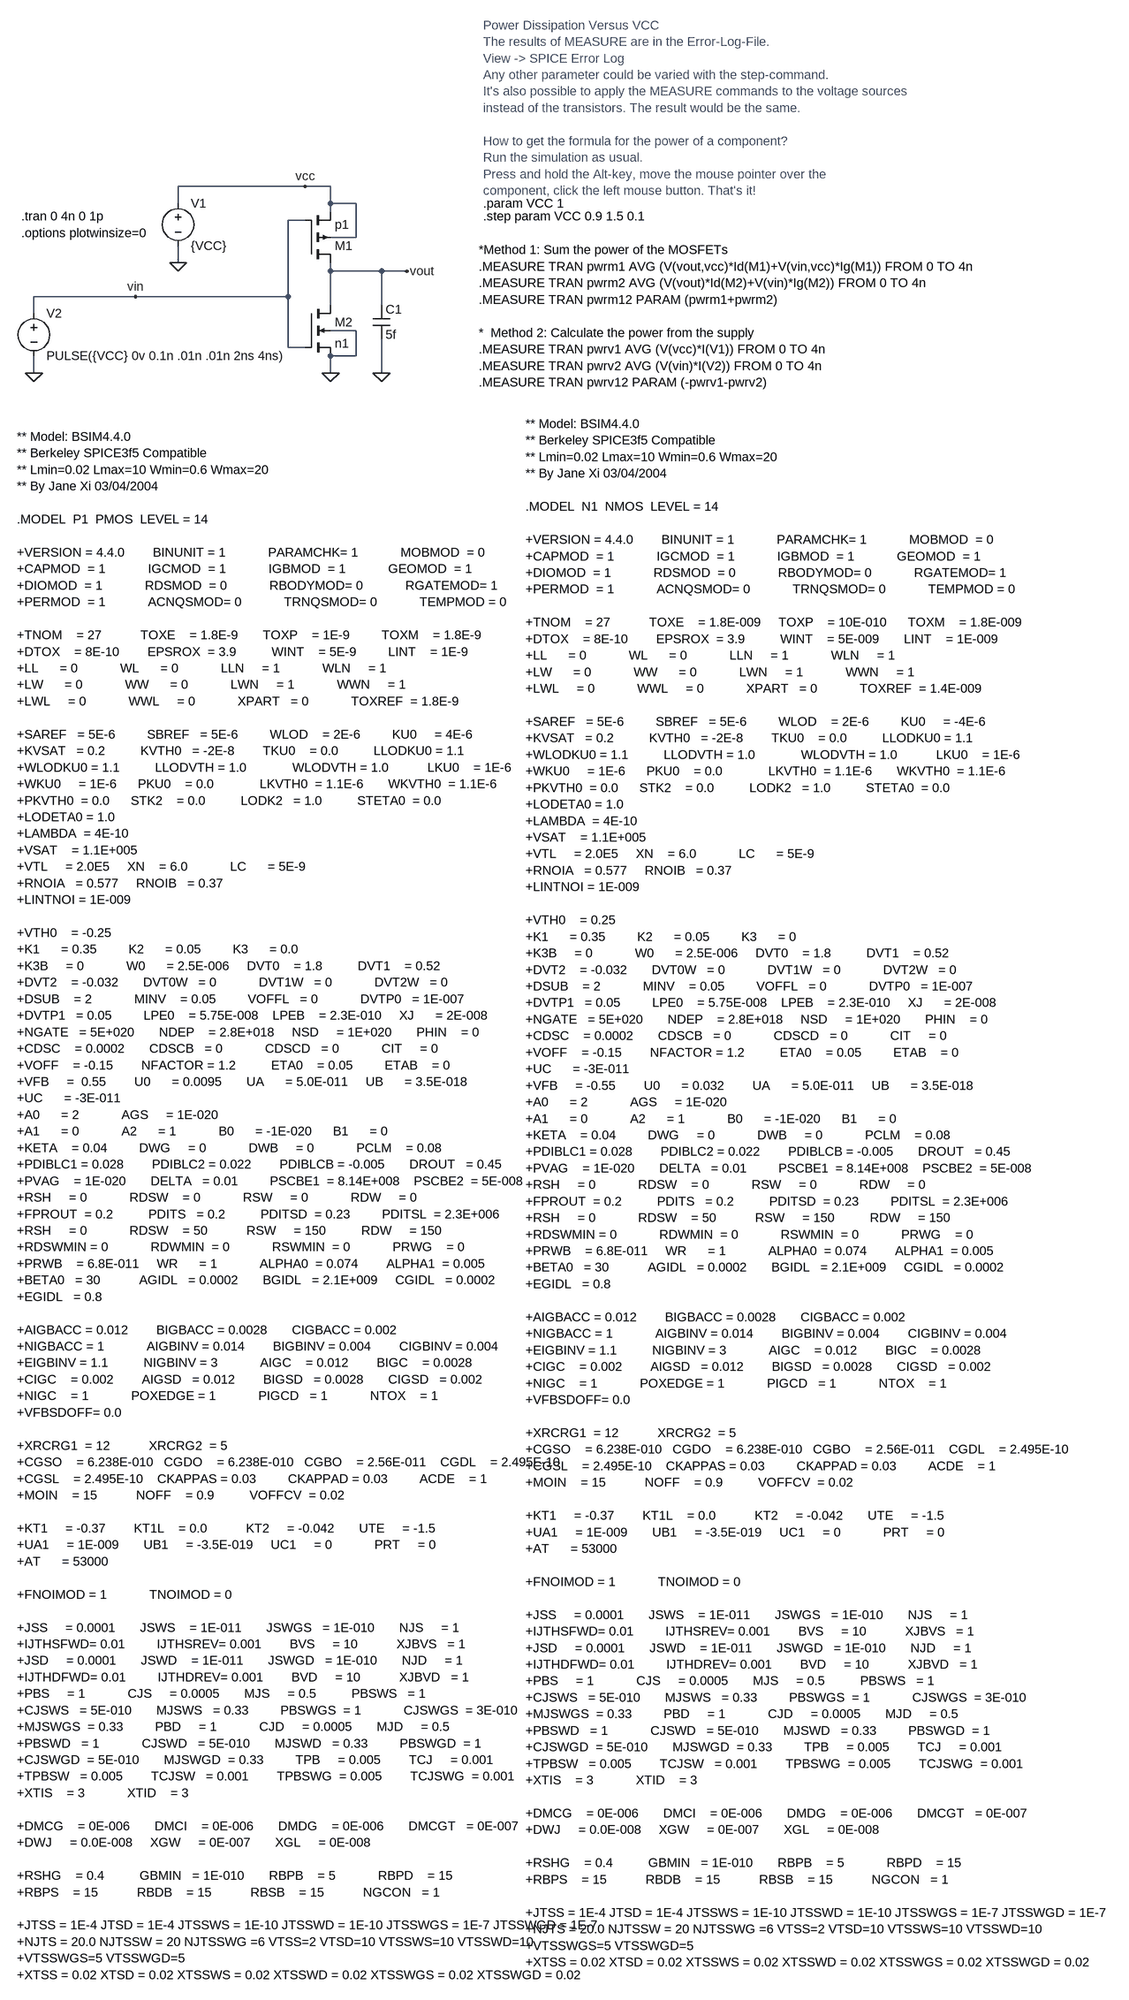
[diagram p0: schematic cmos__inverter_pwr_vcc.asc]
cmos__inverter_pwr_vcc.asc, the LTspice schematic file:
Version 4
SHEET 1 2036 3176
WIRE 224 64 -16 64
WIRE 272 64 224 64
WIRE -16 96 -16 64
WIRE 272 96 272 64
WIRE 320 96 272 96
WIRE 272 112 272 96
WIRE 224 128 192 128
WIRE 320 160 320 96
WIRE 320 160 272 160
WIRE -16 208 -16 176
WIRE 272 224 272 208
WIRE 368 224 272 224
WIRE 416 224 368 224
WIRE -96 272 -288 272
WIRE 192 272 192 128
WIRE 192 272 -96 272
WIRE 272 288 272 224
WIRE 368 288 368 224
WIRE -288 304 -288 272
WIRE 320 336 272 336
WIRE 192 368 192 272
WIRE 224 368 192 368
WIRE 320 384 320 336
WIRE 320 384 272 384
WIRE -288 416 -288 384
WIRE 272 416 272 384
WIRE 368 416 368 352
FLAG 272 416 0
FLAG -16 208 0
FLAG -288 416 0
FLAG 416 224 vout
FLAG -96 272 vin
FLAG 368 416 0
FLAG 224 64 vcc
SYMBOL pmos4 224 208 M180
SYMATTR InstName M1
SYMATTR Value p1
SYMATTR Value2 l=90n w=.2u ad=.9p as=.9p pd=250n ps=250n m=1
SYMBOL nmos4 224 288 R0
SYMATTR InstName M2
SYMATTR Value n1
SYMATTR Value2 l=90n w=.1u ad=.9p as=.9p pd=250n ps=250n m=1
SYMBOL voltage -16 80 R0
WINDOW 123 0 0 Left 0
WINDOW 39 0 0 Left 0
SYMATTR InstName V1
SYMATTR Value {VCC}
SYMBOL voltage -288 288 R0
WINDOW 123 0 0 Left 0
WINDOW 39 0 0 Left 0
SYMATTR InstName V2
SYMATTR Value PULSE({VCC} 0v 0.1n .01n .01n 2ns 4ns)
SYMBOL cap 352 288 R0
SYMATTR InstName C1
SYMATTR Value 5f
TEXT -320 536 Left 0 !** Model: BSIM4.4.0\n** Berkeley SPICE3f5 Compatible\n** Lmin=0.02 Lmax=10 Wmin=0.6 Wmax=20\n** By Jane Xi 03/04/2004\n \n.MODEL  P1  PMOS  LEVEL = 14\n \n+VERSION = 4.4.0        BINUNIT = 1            PARAMCHK= 1            MOBMOD  = 0          \n+CAPMOD  = 1            IGCMOD  = 1            IGBMOD  = 1            GEOMOD  = 1          \n+DIOMOD  = 1            RDSMOD  = 0            RBODYMOD= 0            RGATEMOD= 1          \n+PERMOD  = 1            ACNQSMOD= 0            TRNQSMOD= 0            TEMPMOD = 0\n \n+TNOM    = 27           TOXE    = 1.8E-9       TOXP    = 1E-9         TOXM    = 1.8E-9   \n+DTOX    = 8E-10        EPSROX  = 3.9          WINT    = 5E-9         LINT    = 1E-9   \n+LL      = 0            WL      = 0            LLN     = 1            WLN     = 1          \n+LW      = 0            WW      = 0            LWN     = 1            WWN     = 1          \n+LWL     = 0            WWL     = 0            XPART   = 0            TOXREF  = 1.8E-9   \n \n+SAREF   = 5E-6         SBREF   = 5E-6         WLOD    = 2E-6         KU0     = 4E-6\n+KVSAT   = 0.2          KVTH0   = -2E-8        TKU0    = 0.0          LLODKU0 = 1.1 \n+WLODKU0 = 1.1          LLODVTH = 1.0  	       WLODVTH = 1.0 	      LKU0    = 1E-6  \n+WKU0	 = 1E-6  	PKU0    = 0.0  	       LKVTH0  = 1.1E-6       WKVTH0  = 1.1E-6   \n+PKVTH0  = 0.0  	STK2    = 0.0          LODK2   = 1.0          STETA0  = 0.0  \n+LODETA0 = 1.0		\n+LAMBDA  = 4E-10\n+VSAT    = 1.1E+005     \n+VTL	 = 2.0E5 	XN	= 6.0 	       LC      = 5E-9 \n+RNOIA   = 0.577 	RNOIB   = 0.37\n+LINTNOI = 1E-009\n \n+VTH0    = -0.25         \n+K1      = 0.35         K2      = 0.05         K3      = 0.0          \n+K3B     = 0            W0      = 2.5E-006     DVT0    = 1.8          DVT1    = 0.52       \n+DVT2    = -0.032       DVT0W   = 0            DVT1W   = 0            DVT2W   = 0          \n+DSUB    = 2            MINV    = 0.05         VOFFL   = 0            DVTP0   = 1E-007     \n+DVTP1   = 0.05         LPE0    = 5.75E-008    LPEB    = 2.3E-010     XJ      = 2E-008     \n+NGATE   = 5E+020       NDEP    = 2.8E+018     NSD     = 1E+020       PHIN    = 0          \n+CDSC    = 0.0002       CDSCB   = 0            CDSCD   = 0            CIT     = 0          \n+VOFF    = -0.15        NFACTOR = 1.2          ETA0    = 0.05         ETAB    = 0          \n+VFB     =  0.55        U0      = 0.0095       UA      = 5.0E-011     UB      = 3.5E-018   \n+UC      = -3E-011      \n+A0      = 2            AGS     = 1E-020     \n+A1      = 0            A2      = 1            B0      = -1E-020      B1      = 0          \n+KETA    = 0.04         DWG     = 0            DWB     = 0            PCLM    = 0.08      \n+PDIBLC1 = 0.028        PDIBLC2 = 0.022        PDIBLCB = -0.005       DROUT   = 0.45       \n+PVAG    = 1E-020       DELTA   = 0.01         PSCBE1  = 8.14E+008    PSCBE2  = 5E-008     \n+RSH     = 0            RDSW    = 0            RSW     = 0            RDW     = 0        \n+FPROUT  = 0.2          PDITS   = 0.2          PDITSD  = 0.23         PDITSL  = 2.3E+006   \n+RSH     = 0            RDSW    = 50           RSW     = 150          RDW     = 150        \n+RDSWMIN = 0            RDWMIN  = 0            RSWMIN  = 0            PRWG    = 0          \n+PRWB    = 6.8E-011     WR      = 1            ALPHA0  = 0.074        ALPHA1  = 0.005      \n+BETA0   = 30           AGIDL   = 0.0002       BGIDL   = 2.1E+009     CGIDL   = 0.0002     \n+EGIDL   = 0.8          \n \n+AIGBACC = 0.012        BIGBACC = 0.0028       CIGBACC = 0.002\n+NIGBACC = 1            AIGBINV = 0.014        BIGBINV = 0.004        CIGBINV = 0.004\n+EIGBINV = 1.1          NIGBINV = 3            AIGC    = 0.012        BIGC    = 0.0028\n+CIGC    = 0.002        AIGSD   = 0.012        BIGSD   = 0.0028       CIGSD   = 0.002\n+NIGC    = 1            POXEDGE = 1            PIGCD   = 1            NTOX    = 1\n+VFBSDOFF= 0.0 \n \n+XRCRG1  = 12           XRCRG2  = 5          \n+CGSO    = 6.238E-010   CGDO    = 6.238E-010   CGBO    = 2.56E-011    CGDL    = 2.495E-10     \n+CGSL    = 2.495E-10    CKAPPAS = 0.03         CKAPPAD = 0.03         ACDE    = 1          \n+MOIN    = 15           NOFF    = 0.9          VOFFCV  = 0.02       \n \n+KT1     = -0.37        KT1L    = 0.0           KT2     = -0.042       UTE     = -1.5\n+UA1     = 1E-009       UB1     = -3.5E-019     UC1     = 0            PRT     = 0\n+AT      = 53000\n \n+FNOIMOD = 1            TNOIMOD = 0          \n \n+JSS     = 0.0001       JSWS    = 1E-011       JSWGS   = 1E-010       NJS     = 1          \n+IJTHSFWD= 0.01         IJTHSREV= 0.001        BVS     = 10           XJBVS   = 1          \n+JSD     = 0.0001       JSWD    = 1E-011       JSWGD   = 1E-010       NJD     = 1          \n+IJTHDFWD= 0.01         IJTHDREV= 0.001        BVD     = 10           XJBVD   = 1          \n+PBS     = 1            CJS     = 0.0005       MJS     = 0.5          PBSWS   = 1          \n+CJSWS   = 5E-010       MJSWS   = 0.33         PBSWGS  = 1            CJSWGS  = 3E-010     \n+MJSWGS  = 0.33         PBD     = 1            CJD     = 0.0005       MJD     = 0.5        \n+PBSWD   = 1            CJSWD   = 5E-010       MJSWD   = 0.33         PBSWGD  = 1          \n+CJSWGD  = 5E-010       MJSWGD  = 0.33         TPB     = 0.005        TCJ     = 0.001      \n+TPBSW   = 0.005        TCJSW   = 0.001        TPBSWG  = 0.005        TCJSWG  = 0.001      \n+XTIS    = 3            XTID    = 3          \n \n+DMCG    = 0E-006       DMCI    = 0E-006       DMDG    = 0E-006       DMCGT   = 0E-007     \n+DWJ     = 0.0E-008     XGW     = 0E-007       XGL     = 0E-008     \n \n+RSHG    = 0.4          GBMIN   = 1E-010       RBPB    = 5            RBPD    = 15         \n+RBPS    = 15           RBDB    = 15           RBSB    = 15           NGCON   = 1          \n \n+JTSS = 1E-4 JTSD = 1E-4 JTSSWS = 1E-10 JTSSWD = 1E-10 JTSSWGS = 1E-7 JTSSWGD = 1E-7  \n+NJTS = 20.0 NJTSSW = 20 NJTSSWG =6 VTSS=2 VTSD=10 VTSSWS=10 VTSSWD=10 \n+VTSSWGS=5 VTSSWGD=5\n+XTSS = 0.02 XTSD = 0.02 XTSSWS = 0.02 XTSSWD = 0.02 XTSSWGS = 0.02 XTSSWGD = 0.02
TEXT 640 512 Left 0 !** Model: BSIM4.4.0\n** Berkeley SPICE3f5 Compatible\n** Lmin=0.02 Lmax=10 Wmin=0.6 Wmax=20\n** By Jane Xi 03/04/2004\n \n.MODEL  N1  NMOS  LEVEL = 14\n \n+VERSION = 4.4.0        BINUNIT = 1            PARAMCHK= 1            MOBMOD  = 0          \n+CAPMOD  = 1            IGCMOD  = 1            IGBMOD  = 1            GEOMOD  = 1          \n+DIOMOD  = 1            RDSMOD  = 0            RBODYMOD= 0            RGATEMOD= 1          \n+PERMOD  = 1            ACNQSMOD= 0            TRNQSMOD= 0            TEMPMOD = 0\n \n+TNOM    = 27           TOXE    = 1.8E-009     TOXP    = 10E-010      TOXM    = 1.8E-009   \n+DTOX    = 8E-10        EPSROX  = 3.9          WINT    = 5E-009       LINT    = 1E-009   \n+LL      = 0            WL      = 0            LLN     = 1            WLN     = 1          \n+LW      = 0            WW      = 0            LWN     = 1            WWN     = 1          \n+LWL     = 0            WWL     = 0            XPART   = 0            TOXREF  = 1.4E-009   \n \n+SAREF   = 5E-6         SBREF   = 5E-6         WLOD    = 2E-6         KU0     = -4E-6\n+KVSAT   = 0.2          KVTH0   = -2E-8        TKU0    = 0.0          LLODKU0 = 1.1 \n+WLODKU0 = 1.1          LLODVTH = 1.0  	       WLODVTH = 1.0 	      LKU0    = 1E-6  \n+WKU0	 = 1E-6  	PKU0    = 0.0  	       LKVTH0  = 1.1E-6       WKVTH0  = 1.1E-6   \n+PKVTH0  = 0.0  	STK2    = 0.0          LODK2   = 1.0          STETA0  = 0.0  \n+LODETA0 = 1.0		\n+LAMBDA  = 4E-10\n+VSAT    = 1.1E+005     \n+VTL	 = 2.0E5 	XN	= 6.0 	       LC      = 5E-9 \n+RNOIA   = 0.577 	RNOIB   = 0.37\n+LINTNOI = 1E-009\n \n+VTH0    = 0.25         \n+K1      = 0.35         K2      = 0.05         K3      = 0          \n+K3B     = 0            W0      = 2.5E-006     DVT0    = 1.8          DVT1    = 0.52       \n+DVT2    = -0.032       DVT0W   = 0            DVT1W   = 0            DVT2W   = 0          \n+DSUB    = 2            MINV    = 0.05         VOFFL   = 0            DVTP0   = 1E-007     \n+DVTP1   = 0.05         LPE0    = 5.75E-008    LPEB    = 2.3E-010     XJ      = 2E-008     \n+NGATE   = 5E+020       NDEP    = 2.8E+018     NSD     = 1E+020       PHIN    = 0          \n+CDSC    = 0.0002       CDSCB   = 0            CDSCD   = 0            CIT     = 0          \n+VOFF    = -0.15        NFACTOR = 1.2          ETA0    = 0.05         ETAB    = 0          \n+UC      = -3E-011      \n+VFB     = -0.55        U0      = 0.032        UA      = 5.0E-011     UB      = 3.5E-018   \n+A0      = 2            AGS     = 1E-020     \n+A1      = 0            A2      = 1            B0      = -1E-020      B1      = 0          \n+KETA    = 0.04         DWG     = 0            DWB     = 0            PCLM    = 0.08      \n+PDIBLC1 = 0.028        PDIBLC2 = 0.022        PDIBLCB = -0.005       DROUT   = 0.45       \n+PVAG    = 1E-020       DELTA   = 0.01         PSCBE1  = 8.14E+008    PSCBE2  = 5E-008     \n+RSH     = 0            RDSW    = 0            RSW     = 0            RDW     = 0        \n+FPROUT  = 0.2          PDITS   = 0.2          PDITSD  = 0.23         PDITSL  = 2.3E+006   \n+RSH     = 0            RDSW    = 50           RSW     = 150          RDW     = 150        \n+RDSWMIN = 0            RDWMIN  = 0            RSWMIN  = 0            PRWG    = 0          \n+PRWB    = 6.8E-011     WR      = 1            ALPHA0  = 0.074        ALPHA1  = 0.005      \n+BETA0   = 30           AGIDL   = 0.0002       BGIDL   = 2.1E+009     CGIDL   = 0.0002     \n+EGIDL   = 0.8          \n \n+AIGBACC = 0.012        BIGBACC = 0.0028       CIGBACC = 0.002\n+NIGBACC = 1            AIGBINV = 0.014        BIGBINV = 0.004        CIGBINV = 0.004\n+EIGBINV = 1.1          NIGBINV = 3            AIGC    = 0.012        BIGC    = 0.0028\n+CIGC    = 0.002        AIGSD   = 0.012        BIGSD   = 0.0028       CIGSD   = 0.002\n+NIGC    = 1            POXEDGE = 1            PIGCD   = 1            NTOX    = 1\n+VFBSDOFF= 0.0  	\n \n+XRCRG1  = 12           XRCRG2  = 5          \n+CGSO    = 6.238E-010   CGDO    = 6.238E-010   CGBO    = 2.56E-011    CGDL    = 2.495E-10     \n+CGSL    = 2.495E-10    CKAPPAS = 0.03         CKAPPAD = 0.03         ACDE    = 1          \n+MOIN    = 15           NOFF    = 0.9          VOFFCV  = 0.02       \n \n+KT1     = -0.37        KT1L    = 0.0           KT2     = -0.042       UTE     = -1.5\n+UA1     = 1E-009       UB1     = -3.5E-019     UC1     = 0            PRT     = 0\n+AT      = 53000\n \n+FNOIMOD = 1            TNOIMOD = 0          \n \n+JSS     = 0.0001       JSWS    = 1E-011       JSWGS   = 1E-010       NJS     = 1          \n+IJTHSFWD= 0.01         IJTHSREV= 0.001        BVS     = 10           XJBVS   = 1          \n+JSD     = 0.0001       JSWD    = 1E-011       JSWGD   = 1E-010       NJD     = 1          \n+IJTHDFWD= 0.01         IJTHDREV= 0.001        BVD     = 10           XJBVD   = 1          \n+PBS     = 1            CJS     = 0.0005       MJS     = 0.5          PBSWS   = 1          \n+CJSWS   = 5E-010       MJSWS   = 0.33         PBSWGS  = 1            CJSWGS  = 3E-010     \n+MJSWGS  = 0.33         PBD     = 1            CJD     = 0.0005       MJD     = 0.5        \n+PBSWD   = 1            CJSWD   = 5E-010       MJSWD   = 0.33         PBSWGD  = 1          \n+CJSWGD  = 5E-010       MJSWGD  = 0.33         TPB     = 0.005        TCJ     = 0.001      \n+TPBSW   = 0.005        TCJSW   = 0.001        TPBSWG  = 0.005        TCJSWG  = 0.001      \n+XTIS    = 3            XTID    = 3          \n \n+DMCG    = 0E-006       DMCI    = 0E-006       DMDG    = 0E-006       DMCGT   = 0E-007     \n+DWJ     = 0.0E-008     XGW     = 0E-007       XGL     = 0E-008     \n \n+RSHG    = 0.4          GBMIN   = 1E-010       RBPB    = 5            RBPD    = 15         \n+RBPS    = 15           RBDB    = 15           RBSB    = 15           NGCON   = 1          \n \n+JTSS = 1E-4 JTSD = 1E-4 JTSSWS = 1E-10 JTSSWD = 1E-10 JTSSWGS = 1E-7 JTSSWGD = 1E-7  \n+NJTS = 20.0 NJTSSW = 20 NJTSSWG =6 VTSS=2 VTSD=10 VTSSWS=10 VTSSWD=10 \n+VTSSWGS=5 VTSSWGD=5\n+XTSS = 0.02 XTSD = 0.02 XTSSWS = 0.02 XTSSWD = 0.02 XTSSWGS = 0.02 XTSSWGD = 0.02
TEXT -312 120 Left 0 !.tran 0 4n 0 1p
TEXT 552 184 Left 0 !*Method 1: Sum the power of the MOSFETs\n.MEASURE TRAN pwrm1 AVG (V(vout,vcc)*Id(M1)+V(vin,vcc)*Ig(M1)) FROM 0 TO 4n\n.MEASURE TRAN pwrm2 AVG (V(vout)*Id(M2)+V(vin)*Ig(M2)) FROM 0 TO 4n\n.MEASURE TRAN pwrm12 PARAM (pwrm1+pwrm2)\n \n*  Method 2: Calculate the power from the supply\n.MEASURE TRAN pwrv1 AVG (V(vcc)*I(V1)) FROM 0 TO 4n\n.MEASURE TRAN pwrv2 AVG (V(vin)*I(V2)) FROM 0 TO 4n\n.MEASURE TRAN pwrv12 PARAM (-pwrv1-pwrv2)
TEXT -312 152 Left 0 !.options plotwinsize=0
TEXT 560 120 Left 0 !.step param VCC 0.9 1.5 0.1
TEXT 560 96 Left 0 !.param VCC 1
TEXT 560 -240 Left 0 ;Power Dissipation Versus VCC\nThe results of MEASURE are in the Error-Log-File.\nView -> SPICE Error Log\nAny other parameter could be varied with the step-command.\nIt's also possible to apply the MEASURE commands to the voltage sources \ninstead of the transistors. The result would be the same.\n \nHow to get the formula for the power of a component?\nRun the simulation as usual.\nPress and hold the Alt-key, move the mouse pointer over the\ncomponent, click the left mouse button. That's it!

The netlist it stands for:
* cmos__inverter_pwr_vcc.asc
M1 vout vin vcc vcc p1 l=90n w=.2u ad=.9p as=.9p pd=250n ps=250n m=1
M2 vout vin 0 0 n1 l=90n w=.1u ad=.9p as=.9p pd=250n ps=250n m=1
V1 vcc 0 {VCC}
V2 vin 0 PULSE({VCC} 0v 0.1n .01n .01n 2ns 4ns)
C1 vout 0 5f
.model NMOS NMOS
.model PMOS PMOS
.lib standard.mos
** Model: BSIM4.4.0
** Berkeley SPICE3f5 Compatible
** Lmin=0.02 Lmax=10 Wmin=0.6 Wmax=20
** By Jane Xi 03/04/2004
.MODEL  P1  PMOS  LEVEL = 14
+VERSION = 4.4.0        BINUNIT = 1            PARAMCHK= 1            MOBMOD  = 0
+CAPMOD  = 1            IGCMOD  = 1            IGBMOD  = 1            GEOMOD  = 1
+DIOMOD  = 1            RDSMOD  = 0            RBODYMOD= 0            RGATEMOD= 1
+PERMOD  = 1            ACNQSMOD= 0            TRNQSMOD= 0            TEMPMOD = 0
+TNOM    = 27           TOXE    = 1.8E-9       TOXP    = 1E-9         TOXM    = 1.8E-9
+DTOX    = 8E-10        EPSROX  = 3.9          WINT    = 5E-9         LINT    = 1E-9
+LL      = 0            WL      = 0            LLN     = 1            WLN     = 1
+LW      = 0            WW      = 0            LWN     = 1            WWN     = 1
+LWL     = 0            WWL     = 0            XPART   = 0            TOXREF  = 1.8E-9
+SAREF   = 5E-6         SBREF   = 5E-6         WLOD    = 2E-6         KU0     = 4E-6
+KVSAT   = 0.2          KVTH0   = -2E-8        TKU0    = 0.0          LLODKU0 = 1.1
+WLODKU0 = 1.1          LLODVTH = 1.0  	       WLODVTH = 1.0 	      LKU0    = 1E-6
+WKU0	 = 1E-6  	PKU0    = 0.0  	       LKVTH0  = 1.1E-6       WKVTH0  = 1.1E-6
+PKVTH0  = 0.0  	STK2    = 0.0          LODK2   = 1.0          STETA0  = 0.0
+LODETA0 = 1.0
+LAMBDA  = 4E-10
+VSAT    = 1.1E+005
+VTL	 = 2.0E5 	XN	= 6.0 	       LC      = 5E-9
+RNOIA   = 0.577 	RNOIB   = 0.37
+LINTNOI = 1E-009
+VTH0    = -0.25
+K1      = 0.35         K2      = 0.05         K3      = 0.0
+K3B     = 0            W0      = 2.5E-006     DVT0    = 1.8          DVT1    = 0.52
+DVT2    = -0.032       DVT0W   = 0            DVT1W   = 0            DVT2W   = 0
+DSUB    = 2            MINV    = 0.05         VOFFL   = 0            DVTP0   = 1E-007
+DVTP1   = 0.05         LPE0    = 5.75E-008    LPEB    = 2.3E-010     XJ      = 2E-008
+NGATE   = 5E+020       NDEP    = 2.8E+018     NSD     = 1E+020       PHIN    = 0
+CDSC    = 0.0002       CDSCB   = 0            CDSCD   = 0            CIT     = 0
+VOFF    = -0.15        NFACTOR = 1.2          ETA0    = 0.05         ETAB    = 0
+VFB     =  0.55        U0      = 0.0095       UA      = 5.0E-011     UB      = 3.5E-018
+UC      = -3E-011
+A0      = 2            AGS     = 1E-020
+A1      = 0            A2      = 1            B0      = -1E-020      B1      = 0
+KETA    = 0.04         DWG     = 0            DWB     = 0            PCLM    = 0.08
+PDIBLC1 = 0.028        PDIBLC2 = 0.022        PDIBLCB = -0.005       DROUT   = 0.45
+PVAG    = 1E-020       DELTA   = 0.01         PSCBE1  = 8.14E+008    PSCBE2  = 5E-008
+RSH     = 0            RDSW    = 0            RSW     = 0            RDW     = 0
+FPROUT  = 0.2          PDITS   = 0.2          PDITSD  = 0.23         PDITSL  = 2.3E+006
+RSH     = 0            RDSW    = 50           RSW     = 150          RDW     = 150
+RDSWMIN = 0            RDWMIN  = 0            RSWMIN  = 0            PRWG    = 0
+PRWB    = 6.8E-011     WR      = 1            ALPHA0  = 0.074        ALPHA1  = 0.005
+BETA0   = 30           AGIDL   = 0.0002       BGIDL   = 2.1E+009     CGIDL   = 0.0002
+EGIDL   = 0.8
+AIGBACC = 0.012        BIGBACC = 0.0028       CIGBACC = 0.002
+NIGBACC = 1            AIGBINV = 0.014        BIGBINV = 0.004        CIGBINV = 0.004
+EIGBINV = 1.1          NIGBINV = 3            AIGC    = 0.012        BIGC    = 0.0028
+CIGC    = 0.002        AIGSD   = 0.012        BIGSD   = 0.0028       CIGSD   = 0.002
+NIGC    = 1            POXEDGE = 1            PIGCD   = 1            NTOX    = 1
+VFBSDOFF= 0.0
+XRCRG1  = 12           XRCRG2  = 5
+CGSO    = 6.238E-010   CGDO    = 6.238E-010   CGBO    = 2.56E-011    CGDL    = 2.495E-10
+CGSL    = 2.495E-10    CKAPPAS = 0.03         CKAPPAD = 0.03         ACDE    = 1
+MOIN    = 15           NOFF    = 0.9          VOFFCV  = 0.02
+KT1     = -0.37        KT1L    = 0.0           KT2     = -0.042       UTE     = -1.5
+UA1     = 1E-009       UB1     = -3.5E-019     UC1     = 0            PRT     = 0
+AT      = 53000
+FNOIMOD = 1            TNOIMOD = 0
+JSS     = 0.0001       JSWS    = 1E-011       JSWGS   = 1E-010       NJS     = 1
+IJTHSFWD= 0.01         IJTHSREV= 0.001        BVS     = 10           XJBVS   = 1
+JSD     = 0.0001       JSWD    = 1E-011       JSWGD   = 1E-010       NJD     = 1
+IJTHDFWD= 0.01         IJTHDREV= 0.001        BVD     = 10           XJBVD   = 1
+PBS     = 1            CJS     = 0.0005       MJS     = 0.5          PBSWS   = 1
+CJSWS   = 5E-010       MJSWS   = 0.33         PBSWGS  = 1            CJSWGS  = 3E-010
+MJSWGS  = 0.33         PBD     = 1            CJD     = 0.0005       MJD     = 0.5
+PBSWD   = 1            CJSWD   = 5E-010       MJSWD   = 0.33         PBSWGD  = 1
+CJSWGD  = 5E-010       MJSWGD  = 0.33         TPB     = 0.005        TCJ     = 0.001
+TPBSW   = 0.005        TCJSW   = 0.001        TPBSWG  = 0.005        TCJSWG  = 0.001
+XTIS    = 3            XTID    = 3
+DMCG    = 0E-006       DMCI    = 0E-006       DMDG    = 0E-006       DMCGT   = 0E-007
+DWJ     = 0.0E-008     XGW     = 0E-007       XGL     = 0E-008
+RSHG    = 0.4          GBMIN   = 1E-010       RBPB    = 5            RBPD    = 15
+RBPS    = 15           RBDB    = 15           RBSB    = 15           NGCON   = 1
+JTSS = 1E-4 JTSD = 1E-4 JTSSWS = 1E-10 JTSSWD = 1E-10 JTSSWGS = 1E-7 JTSSWGD = 1E-7
+NJTS = 20.0 NJTSSW = 20 NJTSSWG =6 VTSS=2 VTSD=10 VTSSWS=10 VTSSWD=10
+VTSSWGS=5 VTSSWGD=5
+XTSS = 0.02 XTSD = 0.02 XTSSWS = 0.02 XTSSWD = 0.02 XTSSWGS = 0.02 XTSSWGD = 0.02
** Model: BSIM4.4.0
** Berkeley SPICE3f5 Compatible
** Lmin=0.02 Lmax=10 Wmin=0.6 Wmax=20
** By Jane Xi 03/04/2004
.MODEL  N1  NMOS  LEVEL = 14
+VERSION = 4.4.0        BINUNIT = 1            PARAMCHK= 1            MOBMOD  = 0
+CAPMOD  = 1            IGCMOD  = 1            IGBMOD  = 1            GEOMOD  = 1
+DIOMOD  = 1            RDSMOD  = 0            RBODYMOD= 0            RGATEMOD= 1
+PERMOD  = 1            ACNQSMOD= 0            TRNQSMOD= 0            TEMPMOD = 0
+TNOM    = 27           TOXE    = 1.8E-009     TOXP    = 10E-010      TOXM    = 1.8E-009
+DTOX    = 8E-10        EPSROX  = 3.9          WINT    = 5E-009       LINT    = 1E-009
+LL      = 0            WL      = 0            LLN     = 1            WLN     = 1
+LW      = 0            WW      = 0            LWN     = 1            WWN     = 1
+LWL     = 0            WWL     = 0            XPART   = 0            TOXREF  = 1.4E-009
+SAREF   = 5E-6         SBREF   = 5E-6         WLOD    = 2E-6         KU0     = -4E-6
+KVSAT   = 0.2          KVTH0   = -2E-8        TKU0    = 0.0          LLODKU0 = 1.1
+WLODKU0 = 1.1          LLODVTH = 1.0  	       WLODVTH = 1.0 	      LKU0    = 1E-6
+WKU0	 = 1E-6  	PKU0    = 0.0  	       LKVTH0  = 1.1E-6       WKVTH0  = 1.1E-6
+PKVTH0  = 0.0  	STK2    = 0.0          LODK2   = 1.0          STETA0  = 0.0
+LODETA0 = 1.0
+LAMBDA  = 4E-10
+VSAT    = 1.1E+005
+VTL	 = 2.0E5 	XN	= 6.0 	       LC      = 5E-9
+RNOIA   = 0.577 	RNOIB   = 0.37
+LINTNOI = 1E-009
+VTH0    = 0.25
+K1      = 0.35         K2      = 0.05         K3      = 0
+K3B     = 0            W0      = 2.5E-006     DVT0    = 1.8          DVT1    = 0.52
+DVT2    = -0.032       DVT0W   = 0            DVT1W   = 0            DVT2W   = 0
+DSUB    = 2            MINV    = 0.05         VOFFL   = 0            DVTP0   = 1E-007
+DVTP1   = 0.05         LPE0    = 5.75E-008    LPEB    = 2.3E-010     XJ      = 2E-008
+NGATE   = 5E+020       NDEP    = 2.8E+018     NSD     = 1E+020       PHIN    = 0
+CDSC    = 0.0002       CDSCB   = 0            CDSCD   = 0            CIT     = 0
+VOFF    = -0.15        NFACTOR = 1.2          ETA0    = 0.05         ETAB    = 0
+UC      = -3E-011
+VFB     = -0.55        U0      = 0.032        UA      = 5.0E-011     UB      = 3.5E-018
+A0      = 2            AGS     = 1E-020
+A1      = 0            A2      = 1            B0      = -1E-020      B1      = 0
+KETA    = 0.04         DWG     = 0            DWB     = 0            PCLM    = 0.08
+PDIBLC1 = 0.028        PDIBLC2 = 0.022        PDIBLCB = -0.005       DROUT   = 0.45
+PVAG    = 1E-020       DELTA   = 0.01         PSCBE1  = 8.14E+008    PSCBE2  = 5E-008
+RSH     = 0            RDSW    = 0            RSW     = 0            RDW     = 0
+FPROUT  = 0.2          PDITS   = 0.2          PDITSD  = 0.23         PDITSL  = 2.3E+006
+RSH     = 0            RDSW    = 50           RSW     = 150          RDW     = 150
+RDSWMIN = 0            RDWMIN  = 0            RSWMIN  = 0            PRWG    = 0
+PRWB    = 6.8E-011     WR      = 1            ALPHA0  = 0.074        ALPHA1  = 0.005
+BETA0   = 30           AGIDL   = 0.0002       BGIDL   = 2.1E+009     CGIDL   = 0.0002
+EGIDL   = 0.8
+AIGBACC = 0.012        BIGBACC = 0.0028       CIGBACC = 0.002
+NIGBACC = 1            AIGBINV = 0.014        BIGBINV = 0.004        CIGBINV = 0.004
+EIGBINV = 1.1          NIGBINV = 3            AIGC    = 0.012        BIGC    = 0.0028
+CIGC    = 0.002        AIGSD   = 0.012        BIGSD   = 0.0028       CIGSD   = 0.002
+NIGC    = 1            POXEDGE = 1            PIGCD   = 1            NTOX    = 1
+VFBSDOFF= 0.0
+XRCRG1  = 12           XRCRG2  = 5
+CGSO    = 6.238E-010   CGDO    = 6.238E-010   CGBO    = 2.56E-011    CGDL    = 2.495E-10
+CGSL    = 2.495E-10    CKAPPAS = 0.03         CKAPPAD = 0.03         ACDE    = 1
+MOIN    = 15           NOFF    = 0.9          VOFFCV  = 0.02
+KT1     = -0.37        KT1L    = 0.0           KT2     = -0.042       UTE     = -1.5
+UA1     = 1E-009       UB1     = -3.5E-019     UC1     = 0            PRT     = 0
+AT      = 53000
+FNOIMOD = 1            TNOIMOD = 0
+JSS     = 0.0001       JSWS    = 1E-011       JSWGS   = 1E-010       NJS     = 1
+IJTHSFWD= 0.01         IJTHSREV= 0.001        BVS     = 10           XJBVS   = 1
+JSD     = 0.0001       JSWD    = 1E-011       JSWGD   = 1E-010       NJD     = 1
+IJTHDFWD= 0.01         IJTHDREV= 0.001        BVD     = 10           XJBVD   = 1
+PBS     = 1            CJS     = 0.0005       MJS     = 0.5          PBSWS   = 1
+CJSWS   = 5E-010       MJSWS   = 0.33         PBSWGS  = 1            CJSWGS  = 3E-010
+MJSWGS  = 0.33         PBD     = 1            CJD     = 0.0005       MJD     = 0.5
+PBSWD   = 1            CJSWD   = 5E-010       MJSWD   = 0.33         PBSWGD  = 1
+CJSWGD  = 5E-010       MJSWGD  = 0.33         TPB     = 0.005        TCJ     = 0.001
+TPBSW   = 0.005        TCJSW   = 0.001        TPBSWG  = 0.005        TCJSWG  = 0.001
+XTIS    = 3            XTID    = 3
+DMCG    = 0E-006       DMCI    = 0E-006       DMDG    = 0E-006       DMCGT   = 0E-007
+DWJ     = 0.0E-008     XGW     = 0E-007       XGL     = 0E-008
+RSHG    = 0.4          GBMIN   = 1E-010       RBPB    = 5            RBPD    = 15
+RBPS    = 15           RBDB    = 15           RBSB    = 15           NGCON   = 1
+JTSS = 1E-4 JTSD = 1E-4 JTSSWS = 1E-10 JTSSWD = 1E-10 JTSSWGS = 1E-7 JTSSWGD = 1E-7
+NJTS = 20.0 NJTSSW = 20 NJTSSWG =6 VTSS=2 VTSD=10 VTSSWS=10 VTSSWD=10
+VTSSWGS=5 VTSSWGD=5
+XTSS = 0.02 XTSD = 0.02 XTSSWS = 0.02 XTSSWD = 0.02 XTSSWGS = 0.02 XTSSWGD = 0.02
.tran 0 4n 0 1p
*Method 1: Sum the power of the MOSFETs
.MEASURE TRAN pwrm1 AVG (V(vout,vcc)*Id(M1)+V(vin,vcc)*Ig(M1)) FROM 0 TO 4n
.MEASURE TRAN pwrm2 AVG (V(vout)*Id(M2)+V(vin)*Ig(M2)) FROM 0 TO 4n
.MEASURE TRAN pwrm12 PARAM (pwrm1+pwrm2)
*  Method 2: Calculate the power from the supply
.MEASURE TRAN pwrv1 AVG (V(vcc)*I(V1)) FROM 0 TO 4n
.MEASURE TRAN pwrv2 AVG (V(vin)*I(V2)) FROM 0 TO 4n
.MEASURE TRAN pwrv12 PARAM (-pwrv1-pwrv2)
.options plotwinsize=0
.step param VCC 0.9 1.5 0.1
.param VCC 1
* Power Dissipation Versus VCC
* The results of MEASURE are in the Error-Log-File.
* View -> SPICE Error Log
* Any other parameter could be varied with the step-command.
* It's also possible to apply the MEASURE commands to the voltage sources
* instead of the transistors. The result would be the same.
* How to get the formula for the power of a component?
* Run the simulation as usual.
* Press and hold the Alt-key, move the mouse pointer over the
* component, click the left mouse button. That's it!
.backanno
.end